# EAGLE design 3DAM_V2 (EAGLE 7.6.0)
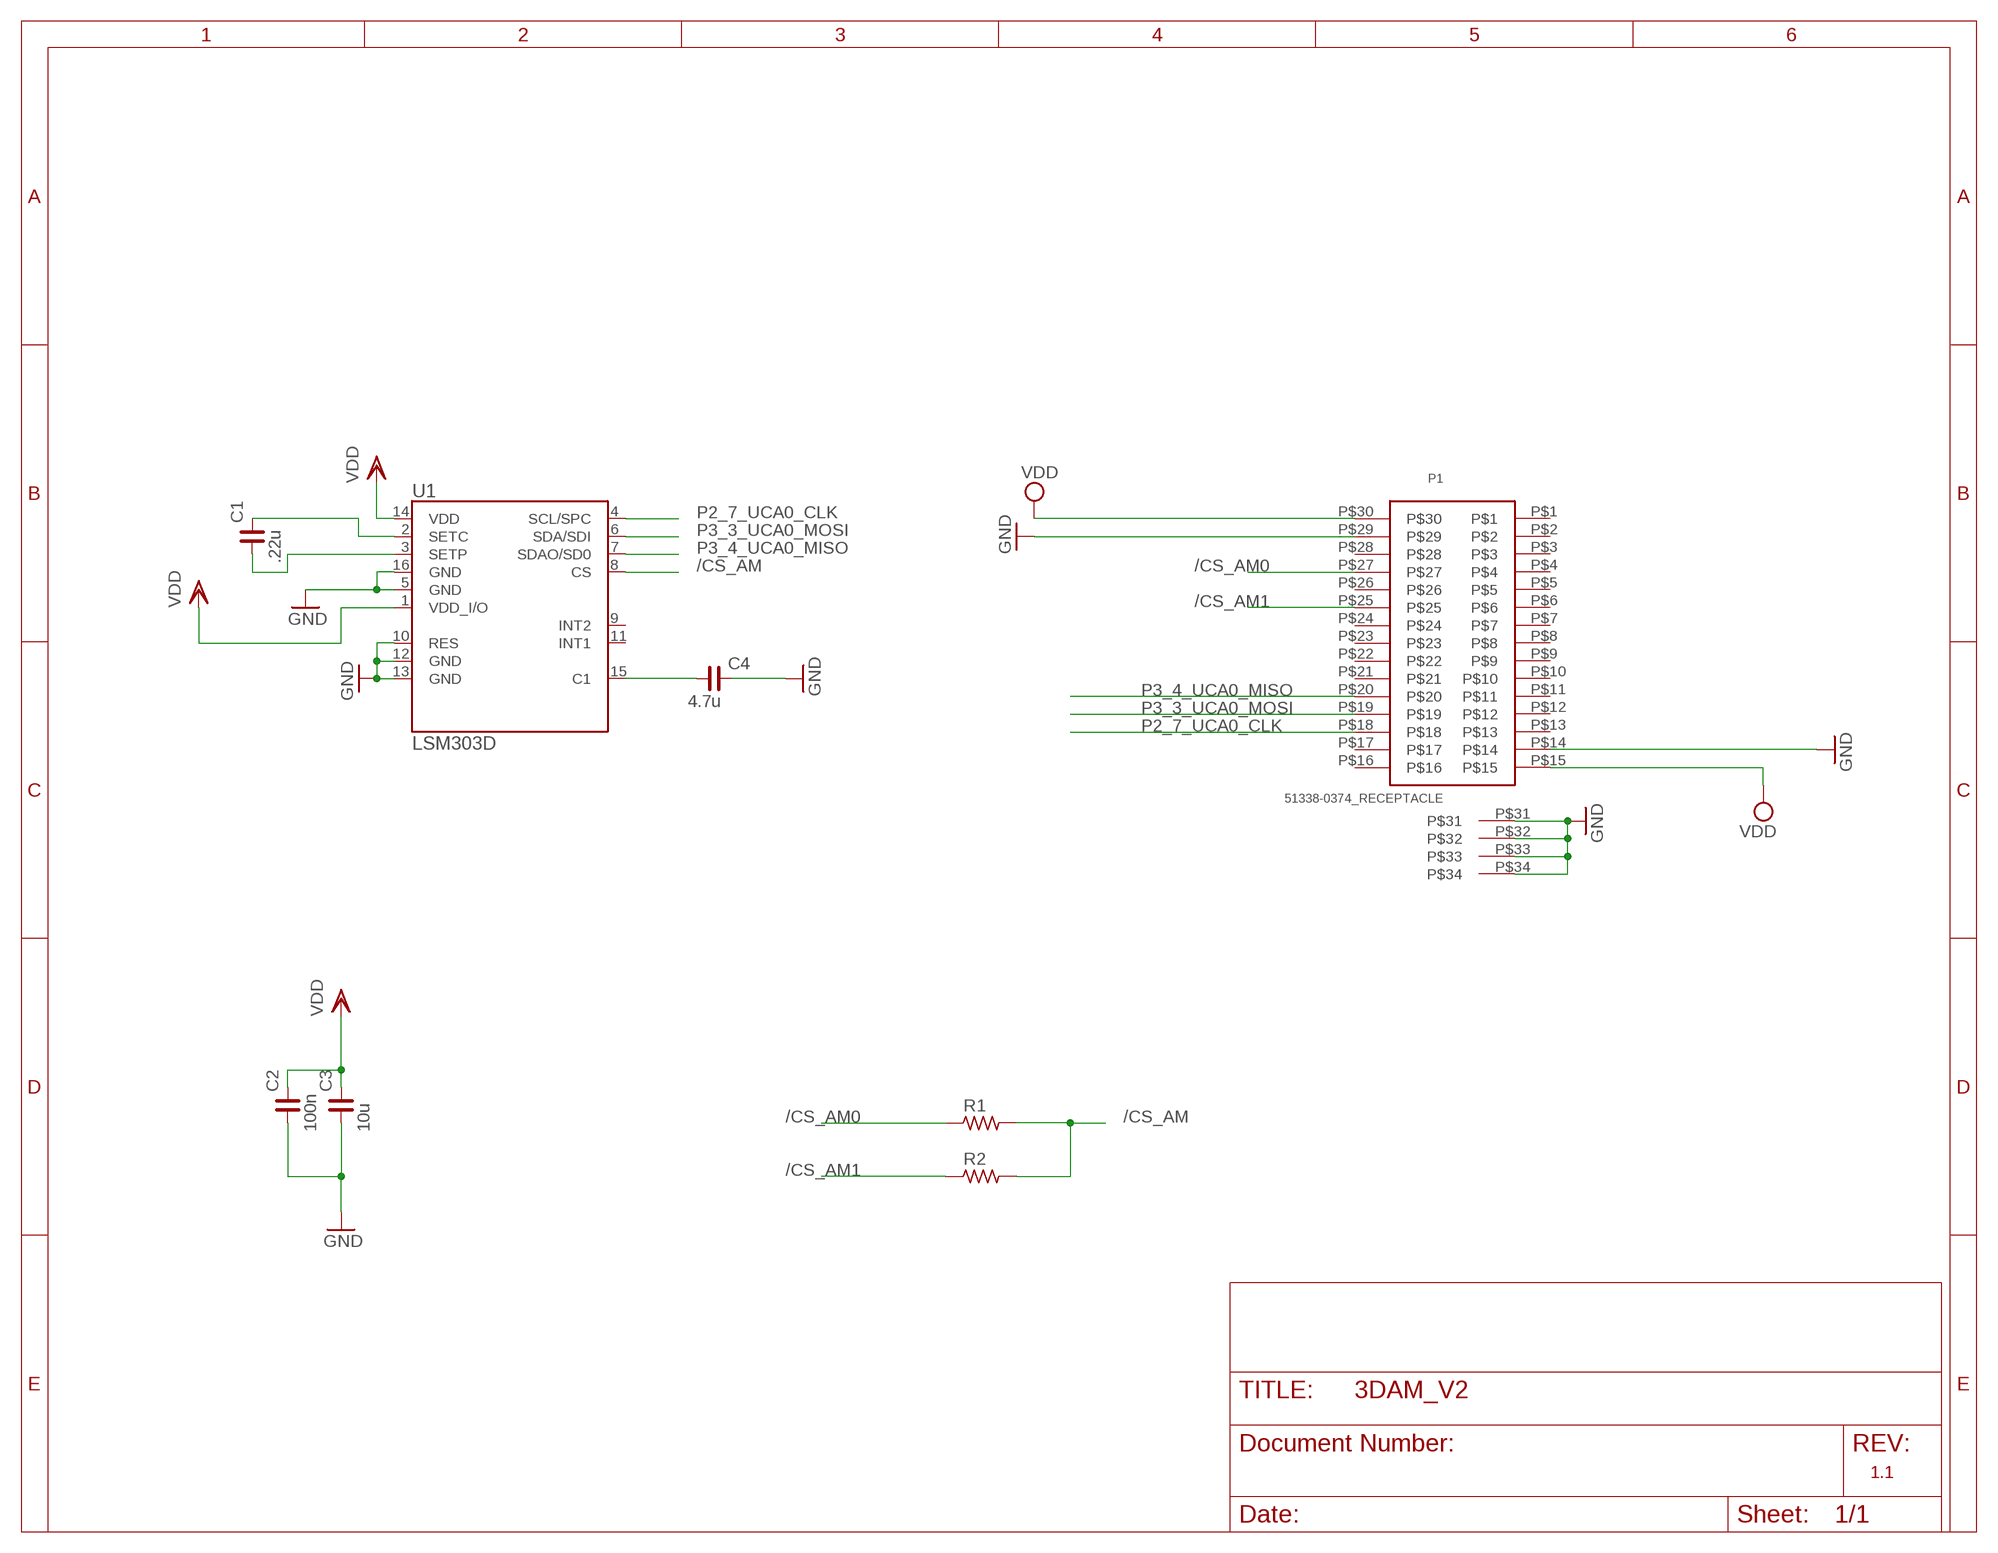
[diagram p0: schematic, sheet 1]

## Parts
C1  .22u  C_0402  [C0402]
C2  100n  C_0402  [C0402]
C3  10u  C_0402  [C0402]
C4  4.7u  C_0402  [C0402]
P1  51338-0374_RECEPTACLE  [51338-0374_RECEPTACLE]
R1  R_0402  [R0402]
R2  R_0402  [R0402]
U1  LSM303D  [LGA16-3MM]

## Nets
/CS_AM: R1.2 R2.2 U1.8(CS)
/CS_AM0: P1.P$27 R1.1
/CS_AM1: P1.P$25 R2.1
GND: C2.1 C3.1 C4.2 P1.P$14 P1.P$29 P1.P$31 P1.P$32 P1.P$33 P1.P$34 U1.5(GND) U1.10(RES) U1.12(GND) U1.13(GND) U1.16(GND)
N$2: C1.2 U1.2(SETC)
N$3: C1.1 U1.3(SETP)
N$4: C4.1 U1.15(C1)
P2_7_UCA0_CLK: P1.P$18 U1.4(SCL/SPC)
P3_3_UCA0_MOSI: P1.P$19 U1.6(SDA/SDI)
P3_4_UCA0_MISO: P1.P$20 U1.7(SDAO/SD0)
VDD: C2.2 C3.2 P1.P$15 P1.P$30 U1.1(VDD_I/O) U1.14(VDD)
Unconnected: P1.P$1 P1.P$2 P1.P$3 P1.P$4 P1.P$5 P1.P$6 P1.P$7 P1.P$8 P1.P$9 P1.P$10 P1.P$11 P1.P$12 P1.P$13 P1.P$16 P1.P$17 P1.P$21 P1.P$22 P1.P$23 P1.P$24 P1.P$26 P1.P$28 U1.9(INT2) U1.11(INT1)

## Notes on the sheet
- 1.1

## Library data of the parts
C1-C4 = rc-master-smd:C_: NON-POLARIZED CAP
P1 = Molex_SlimStack:51338-0374_RECEPTACLE
R1 R2 = rc-master-smd:R_: RESISTOR
U1 = SparkFun-Sensors:LSM303D

## Board
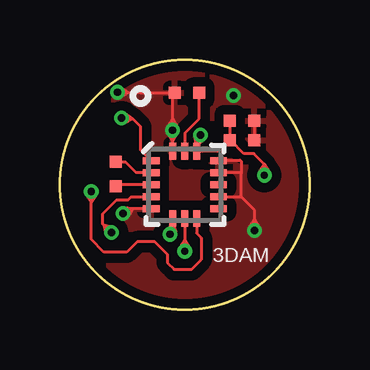
[diagram p1: board, top side]
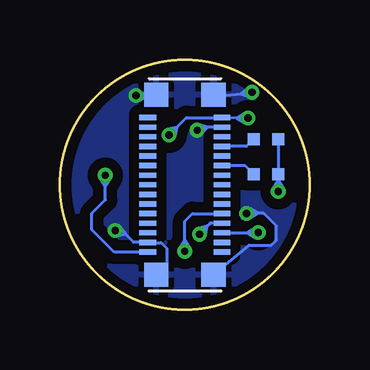
[diagram p2: board, bottom side, seen from below]

Size 10.4 x 10.4 mm. Coordinates in mm from the lower left corner, seen from the top.
Outline: circle at 5.2,5.2 radius 5.2
Copper layers (1*16): Top 0.035mm / dielectric 1.5mm / Bottom 0.035mm
Design rules "DIRTY_PCB": minimum track width 5mil, minimum drill 12mil, track to track 5mil, track to pad 5mil, pad to pad 5mil, via to via 5mil, smd to smd 0mil, copper to edge 10mil, drill to drill 10mil, minimum pad ring 10mil, minimum via ring 6mil, stop-mask expansion 2mil, vias tented up to drill 25mil, thermal gap 10mil

### Footprints (pad centres in the part's own frame; a part is rotated, then mirrored left to right if it is on the bottom)
C0402 = smd 0.5 x 0.5: 1 -0.508,0; 2 0.508,0
51338-0374_RECEPTACLE = smd 0.7 x 0.22: P$1 -1.55,2.8; P$2 -1.55,2.4; P$3 -1.55,2; P$4 -1.55,1.6; P$5 -1.55,1.2; P$6 -1.55,0.8; P$7 -1.55,0.4; P$8 -1.55,0; P$9 -1.55,-0.4; P$10 -1.55,-0.8; P$11 -1.55,-1.2; P$12 -1.55,-1.6; P$13 -1.55,-2; P$14 -1.55,-2.4; P$15 -1.55,-2.8; P$16 1.55,-2.8; P$17 1.55,-2.4; P$18 1.55,-2; P$19 1.55,-1.6; P$20 1.55,-1.2; P$21 1.55,-0.8; P$22 1.55,-0.4; P$23 1.55,0; P$24 1.55,0.4; P$25 1.55,0.8; P$26 1.55,1.2; P$27 1.55,1.6; P$28 1.55,2; P$29 1.55,2.4; P$30 1.55,2.8 | smd 1.008 x 1: P$31 1.196,3.75; P$32 -1.196,3.75; P$33 -1.196,-3.75; P$34 1.196,-3.75
R0402 = smd 0.5 x 0.5: 1 -0.508,0; 2 0.508,0
LGA16-3MM = smd 0.7 x 0.28: 1 -1.4,1; 2 -1.4,0.5; 3 -1.4,0; 4 -1.4,-0.5; 5 -1.4,-1; 9 1.4,-1; 10 1.4,-0.5; 11 1.4,0; 12 1.4,0.5; 13 1.4,1 | smd 0.28 x 0.7: 6 -0.5,-1.4; 7 0,-1.4; 8 0.5,-1.4; 14 0.5,1.4; 15 0,1.4; 16 -0.5,1.4

### Placement (x,y rotation side)
C1  2.31,5.64 90 top
C2  7.58,7.05 180 top
C3  7.59,7.88 180 top
C4  5.29,9.03 180 top
P1  5.2,5.2 0 bottom
R1  1.82,7.11 0 bottom
R2  1.82,5.64 0 bottom
U1  5.2,5.2 0 top

### Tracks (layer width: path | path; a pad name or v marks a point on that pad's centre or on a via)
/CS_AM  (via drill 0.3)
  Top 0.127: U1.8 5.72,3.77 5.69,3.74 5.69,3.18 5.88,2.99 5.88,2.08 5.49,1.68 4.76,1.68 4.48,1.96 4.48,2.3 3.95,2.82 3.21,2.82 2.78,2.39 1.83,2.39 1.3,2.92 1.3,4.46 | 1.3,4.46 v1.3,4.92 | 1.3,4.46 1.51,4.79 v1.3,4.92 | 1.3,4.46 1.1,4.79 v1.3,4.92
  Bottom 0.127: R1.2 R2.2 1.31,5.38 | v1.3,4.92 v1.31,4.93 1.31,5.38 | 1.31,5.38 1.1,5.05 v1.3,4.92 | 1.31,5.38 1.51,5.05 v1.3,4.92
/CS_AM0
  Bottom 0.127: R1.1 2.63,6.8 P1.P$27
/CS_AM1
  Bottom 0.127: R2.1 2.69,6 P1.P$25
GND  (via drill 0.3)
  Top 0.127: U1.13 6.63,6.23 7.5,6.23 7.56,6.17 7.56,5.69 7.55,5.7 | 7.55,5.7 U1.12 | 7.55,5.7 7.55,4.69 U1.10 7.55,4.7 8.1,4.15 8.1,3.75 | v2.39,9.06 3.36,9.03 C4.2 arc90 4.71,8.95 4.71,7.93 | U1.16 4.71,7.01 | 4.71,7.47 4.71,7.93 | 4.71,7.01 4.71,7.47 | 4.71,7.47 v4.68,7.47 | C3.1 C2.1 | 8.1,3.75 v8.1,3.29 | U1.5 3.04,4.2 | 3.04,4.2 2.82,4.2 v2.62,4.01 | 8.1,3.75 7.9,3.42 v8.1,3.29 | 8.1,3.75 8.31,3.42 v8.1,3.29 | v2.39,9.06 2.53,9.26 2.85,9.04 2.51,8.85 v2.39,9.06 | 4.71,7.93 4.49,7.61 v4.68,7.47 | 4.71,7.93 4.9,7.59 v4.68,7.47 | 4.71,7.01 4.9,7.35 v4.68,7.47 | 4.71,7.01 4.49,7.33 v4.68,7.47 | 3.04,4.2 2.66,4.25 v2.62,4.01 | 3.04,4.2 2.83,3.88 v2.62,4.01
  Bottom 0.127: 3.7,8.9 P1.P$31 3.7,8.9 2.85,9 | 2.85,9 v2.39,9.06 | P1.P$32 6.68,8.92 6.78,8.92 | 6.78,8.92 v7.23,8.92 | P1.P$29 4.25,7.6 | 4.25,7.6 4.56,7.6 v4.68,7.47 | 7.67,3.14 7.33,2.81 6.78,2.81 6.75,2.84 P1.P$14 6.74,2.79 6.19,2.79 5.96,2.56 5.96,1.77 6.28,1.45 P1.P$33 | 7.67,3.14 7.81,3.29 v8.1,3.29 | P1.P$34 2.52,2.68 1.6,2.68 1.39,2.89 1.39,3.49 1.91,4.01 2.17,4.01 | 2.17,4.01 v2.62,4.01 | 7.67,3.14 8.05,3.06 v8.1,3.29 | 7.67,3.14 7.91,3.44 v8.1,3.29 | 2.85,9 2.54,9.25 v2.39,9.06 | 2.85,9 2.5,8.84 v2.39,9.06 | 6.78,8.92 7.11,8.71 v7.23,8.92 | 6.78,8.92 7.11,9.12 v7.23,8.92 | 4.25,7.6 4.5,7.31 v4.68,7.47 | 4.25,7.6 4.62,7.7 v4.68,7.47 | 2.17,4.01 2.5,3.8 v2.62,4.01 | 2.17,4.01 2.5,4.21 v2.62,4.01
  pour Top (isolate 0.4): 0.2,5.2 arc-90 5.2,10.2 arc-90 10.2,5.2 arc-90 5.2,0.2 arc-91
  pour Bottom (isolate 0.432): 0.2,5.2 arc-90 5.2,10.2 arc-90 10.2,5.2 arc-90 5.2,0.2 arc-91
N$2
  Top 0.127: U1.2 3.17,5.71 2.73,6.15 C1.2
N$3
  Top 0.127: 2.29,4.95 C1.1 2.38,5.2 U1.3
N$4
  Top 0.127: U1.15 5.22,6.62 5.22,7.37 5.8,7.95 C4.1
P2_7_UCA0_CLK  (via drill 0.3)
  Top 0.127: v2.14,3.21 1.82,3.53 | 1.82,3.53 1.78,3.57 1.78,3.99 2.36,4.57 2.84,4.57 2.96,4.7 U1.4 | 1.82,3.53 1.91,3.15 v2.14,3.21 | 1.82,3.53 2.19,3.44 v2.14,3.21
  Bottom 0.127: P1.P$18 2.6,3.2 | 2.6,3.2 v2.15,3.2 v2.14,3.21 | 2.6,3.2 2.27,3.41 v2.14,3.21 | 2.6,3.2 2.26,3 v2.14,3.21
P3_3_UCA0_MOSI  (via drill 0.3)
  Top 0.127: U1.6 4.7,3.58 | 4.7,3.58 4.7,3.25 v4.59,3.14 | 4.7,3.58 4.42,3.31 v4.59,3.14 | 4.7,3.58 4.82,3.21 v4.59,3.14
  Bottom 0.127: P1.P$19 3.99,3.61 4,3.6 4.15,3.6 4.28,3.47 | 4.28,3.47 4.57,3.18 v4.59,3.14 | 4.28,3.47 4.35,3.09 v4.59,3.14 | 4.28,3.47 4.65,3.37 v4.59,3.14
P3_4_UCA0_MISO  (via drill 0.3)
  Top 0.127: U1.7 5.2,2.89 | 5.2,2.89 v5.2,2.43 | 5.2,2.89 4.99,2.56 v5.2,2.43 | 5.2,2.89 5.4,2.56 v5.2,2.43
  Bottom 0.127: v5.2,2.43 5.2,2.89 | 5.2,2.89 5.2,3.68 4.88,4 P1.P$20 | 5.2,2.89 4.99,2.56 v5.2,2.43 | 5.2,2.89 5.4,2.56 v5.2,2.43
VDD  (via drill 0.3)
  Top 0.127: U1.1 3.36,6.64 3.36,7.61 3.02,7.95 | v2.57,7.98 2.99,7.98 3.02,7.95 | 5.7,6.85 U1.14 5.7,6.61 6.64,6.61 C2.2 | 5.7,6.85 5.7,7.12 v5.86,7.28 | C3.2 C2.2 | v8.51,5.6 8.51,6.05 | 8.51,6.05 8.51,6.06 8.07,6.5 7.66,6.5 7.11,7.05 C2.2 | 3.02,7.95 2.71,8.18 v2.57,7.98 | 3.02,7.95 2.68,7.77 v2.57,7.98 | 5.7,6.85 6.01,7.09 v5.86,7.28 | 5.7,6.85 5.62,7.23 v5.86,7.28 | 8.51,6.05 8.31,5.72 v8.51,5.6 | 8.51,6.05 8.72,5.72 v8.51,5.6
  Bottom 0.127: v2.57,7.98 3.63,7.98 P1.P$30 5.13,8 5.53,7.6 | v5.86,7.28 5.53,7.6 | P1.P$15 6.93,2.39 8.14,2.39 9.07,3.33 9.07,4.01 8.51,4.57 8.51,5.14 | 8.51,5.14 v8.51,5.6 | v2.57,7.98 2.7,8.19 3.03,7.98 2.7,7.78 v2.57,7.98 | 5.53,7.6 5.62,7.22 v5.86,7.28 | 5.53,7.6 5.91,7.51 v5.86,7.28 | 8.51,5.14 8.72,5.47 v8.51,5.6 | 8.51,5.14 8.31,5.47 v8.51,5.6

### Text on the board
tPlace: 3DAM